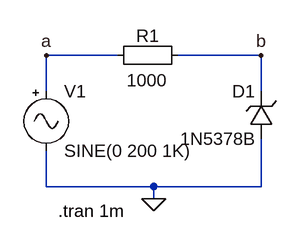
[diagram p0: schematic clipper_parallel.asc]
clipper_parallel.asc, the LTspice schematic file:
Version 4
SHEET 1 880 680
WIRE 0 112 -96 112
WIRE 192 112 80 112
WIRE -96 160 -96 112
WIRE 192 160 192 112
WIRE -96 288 -96 240
WIRE 48 288 -96 288
WIRE 192 288 192 224
WIRE 192 288 48 288
WIRE 48 304 48 288
FLAG 48 304 0
FLAG -96 112 a
FLAG 192 112 b
SYMBOL Misc\\EuropeanResistor 96 96 R90
WINDOW 0 5 56 VBottom 2
WINDOW 3 34 57 VTop 2
SYMATTR InstName R1
SYMATTR Value 1000
SYMBOL zener 208 224 R180
WINDOW 0 24 64 Left 2
WINDOW 3 24 0 Left 2
SYMATTR InstName D1
SYMATTR Value 1N5378B
SYMBOL Misc\\signal -96 144 R0
WINDOW 123 0 0 Left 2
WINDOW 39 0 0 Left 2
SYMATTR InstName V1
SYMATTR Value SINE(0 200 1K)
TEXT -80 320 Left 2 !.tran 1m

The netlist it stands for:
* clipper_parallel.asc
R1 b a 1000
D1 0 b 1N5378B
V1 a 0 SINE(0 200 1K)
.model D D
.lib standard.dio
.tran 1m
.backanno
.end